# EAGLE design IO BOARD TOP (EAGLE 9.6.2)
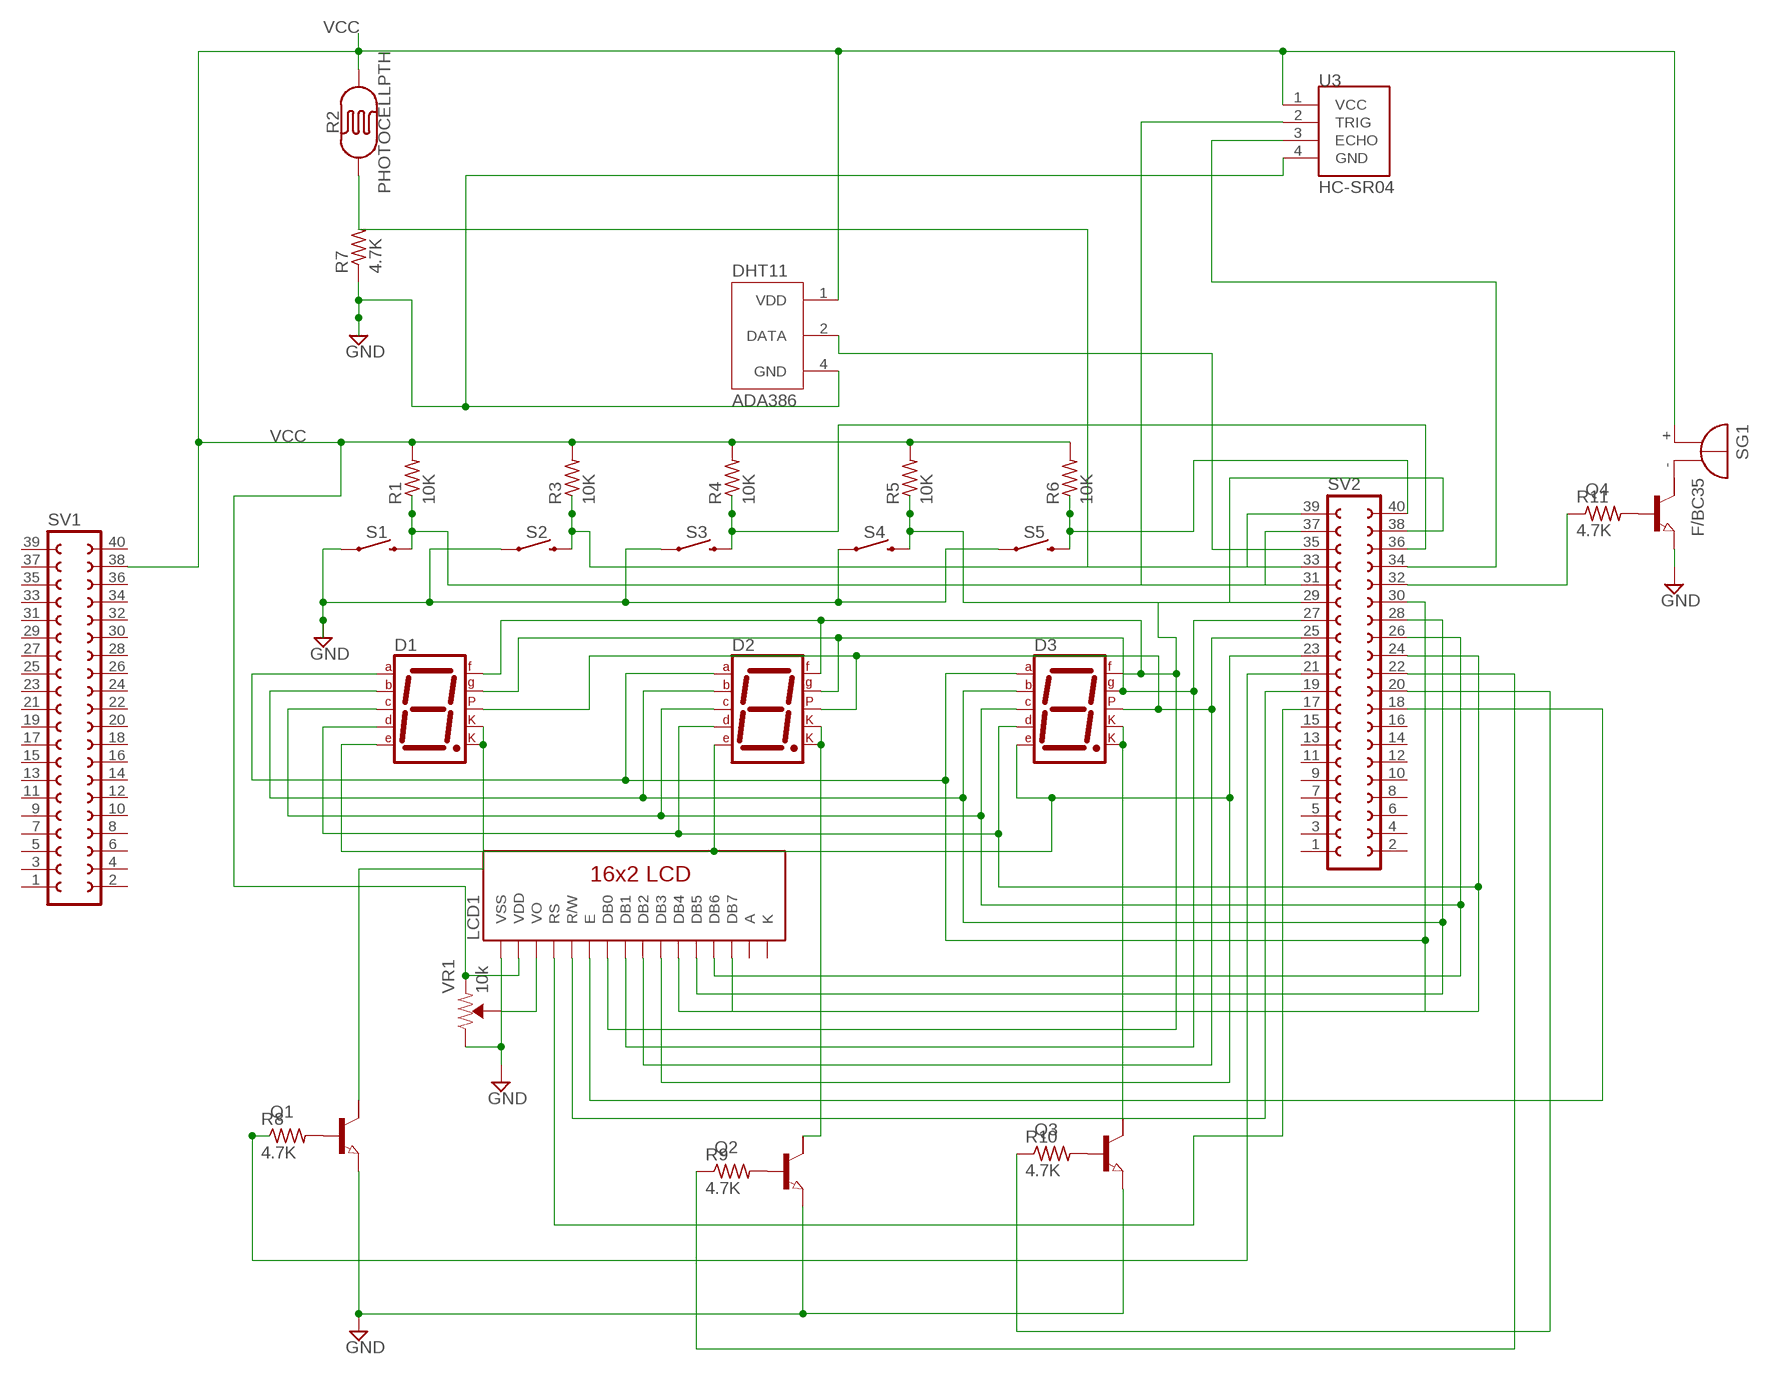
[diagram p0: schematic, sheet 1]

## Parts
D1  7SEG-CK  [7SEG-13]
D2  7SEG-CK  [7SEG-13]
D3  7SEG-CK  [7SEG-13]
DHT11  ADA386  [XDCR_ADA386]
LCD1  LCD-16X2SILK  [LCD-16X2]
Q1  NPN-TRANSISTIOR-2COLSOT89  [SOT89]
Q2  NPN-TRANSISTIOR-2COLSOT89  [SOT89]
Q3  NPN-TRANSISTIOR-2COLSOT89  [SOT89]
Q4  NPN-TRANSISTIOR-2COLSOT89  [SOT89]
R1  10K  R-US_0204/2V  [0204V]
R2  PHOTOCELLPTH  [PHOTOCELL]
R3  10K  R-US_0204/2V  [0204V]
R4  10K  R-US_0204/2V  [0204V]
R5  10K  R-US_0204/2V  [0204V]
R6  10K  R-US_0204/2V  [0204V]
R7  4.7K  R-US_0204/2V  [0204V]
R8  4.7K  R-US_0204/2V  [0204V]
R9  4.7K  R-US_0204/2V  [0204V]
R10  4.7K  R-US_0204/2V  [0204V]
R11  4.7K  R-US_0204/2V  [0204V]
S1  MOMENTARY-SWITCH-SPST-SMD-4.6X2.8MM  [TACTILE_SWITCH_SMD_4.6X2.8MM]
S2  MOMENTARY-SWITCH-SPST-SMD-4.6X2.8MM  [TACTILE_SWITCH_SMD_4.6X2.8MM]
S3  MOMENTARY-SWITCH-SPST-SMD-4.6X2.8MM  [TACTILE_SWITCH_SMD_4.6X2.8MM]
S4  MOMENTARY-SWITCH-SPST-SMD-4.6X2.8MM  [TACTILE_SWITCH_SMD_4.6X2.8MM]
S5  MOMENTARY-SWITCH-SPST-SMD-5.2-REDUNDANT  [TACTILE_SWITCH_SMD_5.2MM]
SG1  F/BC35  [F/BC35]
SV1  FE20-2  [FE20-2]
SV2  FE20-2  [FE20-2]
U3  HC-SR04  [XCVR_HC-SR04]
VR1  10k  TRIMPOT-SMD-3MM-OPEN-1/10W-25%  [TRIMPOT-SMD-TC33X]

## Nets
GND: DHT11.4(GND) LCD1.1(VSS) Q1.3(E) Q2.3(E) Q3.3(E) Q4.3(E) R7.1 S1.1 S1.2 S2.1 S2.2 S3.1 S3.2 S4.1 S4.2 S5.1 S5.2 U3.4(GND) VR1.1(CW)
N$1: R1.1 S1.3 S1.4 SV2.37
N$2: R3.1 S2.3 S2.4 SV2.39
N$3: R4.1 S3.3 S3.4 SV2.36
N$4: R5.1 S4.3 S4.4 SV2.38
N$5: R6.1 S5.3 S5.4 SV2.40
N$6: DHT11.2(DATA) SV2.35
N$7: LCD1.3(VO) VR1.2(WIPER)
N$8: SV2.31 U3.2(TRIG)
N$9: SV2.34 U3.3(ECHO)
N$10: D1.9(F) D2.9(F) D3.9(F) LCD1.7(DB0) SV2.29
N$11: Q4.1(B) R11.2
N$12: D1.6(B) D2.6(B) D3.6(B) LCD1.12(DB5) SV2.28
N$13: R2.1 R7.2 SV2.33
N$14: D1.4(C) D2.4(C) D3.4(C) LCD1.13(DB6) SV2.26
N$15: D1.10(G) D2.10(G) D3.10(G) LCD1.8(DB1) SV2.27
N$16: D1.3(CK1) D1.8(CK2) Q1.2(C)
N$17: D1.1(E) D2.1(E) D3.1(E) LCD1.10(DB3) SV2.23
N$18: D1.7(A) D2.7(A) D3.7(A) LCD1.11(DB4) SV2.30
N$19: D2.3(CK1) D2.8(CK2) Q2.2(C)
N$20: D3.3(CK1) D3.8(CK2) Q3.2(C)
N$21: D1.2(D) D2.2(D) D3.2(D) LCD1.14(DB7) SV2.24
N$22: D1.5(DP) D2.5(DP) D3.5(DP) LCD1.9(DB2) SV2.25
N$23: Q1.1(B) R8.2
N$24: Q2.1(B) R9.2
N$25: Q3.1(B) R10.2
N$27: R9.1 SV2.22
N$28: R10.1 SV2.20
N$29: Q4.2(C) SG1.-
N$30: R11.1 SV2.32
N$31: LCD1.6(E) SV2.18
N$32: LCD1.5(R/W) SV2.19
N$33: LCD1.4(RS) SV2.17
N$35: R8.1 SV2.21
VCC: DHT11.1(VDD) LCD1.2(VDD) R1.2 R2.2 R3.2 R4.2 R5.2 R6.2 SG1.+ SV1.38 U3.1(VCC) VR1.3(CCW)
Unconnected: Q1.2@1(C/) Q2.2@1(C/) Q3.2@1(C/) Q4.2@1(C/) SV1.1 SV1.2 SV1.3 SV1.4 SV1.5 SV1.6 SV1.7 SV1.8 SV1.9 SV1.10 SV1.11 SV1.12 SV1.13 SV1.14 SV1.15 SV1.16 SV1.17 SV1.18 SV1.19 SV1.20 SV1.21 SV1.22 SV1.23 SV1.24 SV1.25 SV1.26 SV1.27 SV1.28 SV1.29 SV1.30 SV1.31 SV1.32 SV1.33 SV1.34 SV1.35 SV1.36 SV1.37 SV1.39 SV1.40 SV2.1 SV2.2 SV2.3 SV2.4 SV2.5 SV2.6 SV2.7 SV2.8 SV2.9 SV2.10 SV2.11 SV2.12 SV2.13 SV2.14 SV2.15 SV2.16

## Power pins joined to a net without a drawn wire
A: LCD1.15(A)
K: LCD1.16(K)

## Library data of the parts
D1-D3 = special:7SEG-CK: 7-segment DISPLAY single cathode, 13 mm
DHT11 = ADA386:ADA386: DHT11 basic temperature-humidity sensor + extras; AVAILABILITY: Unavailable; DESCRIPTION: DHT11 basic temperature-humidity sensor + extras; MF: Adafruit Industries; MP: ADA386; PACKAGE: None; PRICE: None
LCD1 = SparkFun-Displays:LCD-16X2: Standard text-only 16x2 parallel input LCD Basic 16 character by 2 line display. Typically utilizes the extremely common HD44780 parallel interface chipset SparkFun Products: Basic 16x2 Green <https://www.sparkfun.com/products/255> Basic 8x2 Green <https://www.sparkfun.com/products/11122>; PROD_ID: LCD-12633; SF_ID: LCD-00255
Q1-Q4 = semicon-smd-ipc:NPN-TRANSISTIOR-2COL: NPN TRANSISTOR 2 colletor pins
R1 R3-R11 = rcl:R-US_: RESISTOR, American symbol; SPICEPREFIX: R
R2 = SparkFun-Sensors:PHOTOCELL: Photocell (Photodetector, Photo Resistor, CdS) This is a very small light sensor. A photocell changes (also called a photodetector, photo resistor, CdS or photoconductive cell) resistance depending on the amount of light it is exposed to. These little sensors make great ambient light triggers (when light in the room turns on, do something). Datasheet <http://cdn.sparkfun.com/datasheets/Sensors/LightImaging/SEN-09088.pdf> SparkFun Products Mini Photocell <https://www.sparkfun.com/products/9088> (SEN-09088); PROD_ID: COMP-09129; SF_ID: SEN-09088
S1-S4 = SparkFun-Switches:MOMENTARY-SWITCH-SPST: Momentary Switch (Pushbutton) - SPST Normally-open (NO) SPST momentary switches (buttons, pushbuttons). Variants PTH-12MM - 12mm square, through-hole Momentary Pushbutton Switch - 12mm Square <https://www.sparkfun.com/products/9190> (COM-09190) PTH-6.0MM, PTH-6.0MM-KIT - 6.0mm square, through-hole Mini Pushbutton Switch <https://www.sparkfun.com/products/97> (COM-00097) KIT package intended for soldering kit's - only one side of pads' copper is exposed. PTH-RIGHT-ANGLE-KIT - Right-angle, through-hole Right Angle Tactile Button <https://www.sparkfun.com/products/10791> - Used on SparkFun BigTime Watch Kit <https://www.sparkfun.com/products/11734> SMD-12MM - 12mm square, surface-mount Tactile Button - SMD (12mm) <https://www.sparkfun.com/products/12993> (COM-12993) Used on SparkFun PicoBoard <https://www.sparkfun.com/products/11888> SMD-4.5MM - 4.5mm Square Trackball Switch Used on SparkFun Blackberry Trackballer Breakout <https://www.sparkfun.com/products/13169> SMD-4.6MMX2.8MM - 4.60mm x 2.80mm, surface mount Used on SparkFun SAMD21 Mini Breakout <https://www.sparkfun.com/products/13664> SMD-5.2MM, SMD-5.2-REDUNDANT - 5.2mm square, surface-mount Mini Pushbutton Switch - SMD <https://www.sparkfun.com/products/8720> (COM-08720) Used on Arduino Pro Mini <https://www.sparkfun.com/products/11114> REDUNDANT package connects both switch circuits together SMD-6.0X3.5MM - 6.0 x 3.5mm, surface mount Momentary Reset Switch SMD <https://www.sparkfun.com/products/8229> (COM-08229) SMD-6.2MM-TALL - 6.2mm square, surface mount Tactile Button - SMD (6mm) <https://www.sparkfun.com/products/12992> Used on SparkFun Digital Sandbox <https://www.sparkfun.com/products/12651> SMD-RIGHT-ANGLE - Right-angle, surface mount Used on SparkFun Block for Intel® Edison - Arduino <https://www.sparkfun.com/products/13036>; PROD_ID: SWCH-13065
S5 = SparkFun-Switches:MOMENTARY-SWITCH-SPST: Momentary Switch (Pushbutton) - SPST Normally-open (NO) SPST momentary switches (buttons, pushbuttons). Variants PTH-12MM - 12mm square, through-hole Momentary Pushbutton Switch - 12mm Square <https://www.sparkfun.com/products/9190> (COM-09190) PTH-6.0MM, PTH-6.0MM-KIT - 6.0mm square, through-hole Mini Pushbutton Switch <https://www.sparkfun.com/products/97> (COM-00097) KIT package intended for soldering kit's - only one side of pads' copper is exposed. PTH-RIGHT-ANGLE-KIT - Right-angle, through-hole Right Angle Tactile Button <https://www.sparkfun.com/products/10791> - Used on SparkFun BigTime Watch Kit <https://www.sparkfun.com/products/11734> SMD-12MM - 12mm square, surface-mount Tactile Button - SMD (12mm) <https://www.sparkfun.com/products/12993> (COM-12993) Used on SparkFun PicoBoard <https://www.sparkfun.com/products/11888> SMD-4.5MM - 4.5mm Square Trackball Switch Used on SparkFun Blackberry Trackballer Breakout <https://www.sparkfun.com/products/13169> SMD-4.6MMX2.8MM - 4.60mm x 2.80mm, surface mount Used on SparkFun SAMD21 Mini Breakout <https://www.sparkfun.com/products/13664> SMD-5.2MM, SMD-5.2-REDUNDANT - 5.2mm square, surface-mount Mini Pushbutton Switch - SMD <https://www.sparkfun.com/products/8720> (COM-08720) Used on Arduino Pro Mini <https://www.sparkfun.com/products/11114> REDUNDANT package connects both switch circuits together SMD-6.0X3.5MM - 6.0 x 3.5mm, surface mount Momentary Reset Switch SMD <https://www.sparkfun.com/products/8229> (COM-08229) SMD-6.2MM-TALL - 6.2mm square, surface mount Tactile Button - SMD (6mm) <https://www.sparkfun.com/products/12992> Used on SparkFun Digital Sandbox <https://www.sparkfun.com/products/12651> SMD-RIGHT-ANGLE - Right-angle, surface mount Used on SparkFun Block for Intel® Edison - Arduino <https://www.sparkfun.com/products/13036>; PROD_ID: SWCH-08247; SF_SKU: COM-08720
SG1 = buzzer:F/BC35: BUZZER Source: Spoerle; OC_FARNELL: unknown; OC_NEWARK: unknown
SV1 SV2 = con-lsta:FE20-2: FEMALE HEADER; OC_FARNELL: unknown; OC_NEWARK: unknown
U3 = HC-SR04:HC-SR04: Ultrasonic Sensor Module Check prices <https://pricing.snapeda.com/search/part/HC-SR04/?ref=eda>; AVAILABILITY: Bad; DESCRIPTION: HC-SR04 Ultrasonic Sensor Platform Evaluation Expansion Board; MF: OSEPP Electronics LTD; MP: HC-SR04; PACKAGE: None; PRICE: None
VR1 = SparkFun-Resistors:TRIMPOT: Trimming Potentiometer (Trimpot) Three-terminal potentiometers, with an adjustable wiper and two adjustable resistors. A pot can be used to create a configurable voltage divider, or as a variable resistor. "Trimpots" are a subset of potentiometers, usually intended for "set-and-forget" applications. They're often more delicate than standard potentiometers - rated for fewer turns. Variants PTH-KNOB - PTH Trimpot w/ finger-adjustable knob Trimpot 10K with Knob <https://www.sparkfun.com/products/9806> (COM-09806) Datasheet <http://www.sparkfun.com/datasheets/Components/General/TSR-3386.pdf> SMD-3MM-CLOSED-FRAME - SMD 3mm Square Closed-Frame Trimpot Used on e.g. EasyDriver - Stepper Motor Driver <https://www.sparkfun.com/products/12779> Datasheet <http://www.bitechnologies.com/pdfs/22.pdf> (22AR10KTR) SMD-5MM - SMD 5mm Square Closed-Frame Trimpot Used on e.g. IOIO-OTG - V2.2 <https://www.sparkfun.com/products/13613> Datasheet <http://www.vishay.com/docs/51008/ts53.pdf> (TS53YL502MR10) SMD-3MM-1/10W-25% - 3mm Square Open-Frame Trimpot Used on e.g. SparkFun Shapeoko <https://www.sparkfun.com/products/13899> Datasheet <http://www.bourns.com/docs/Product-Datasheets/TC33.pdf> (TC33X-2-103E); PROD_ID: RES-12428, RES-08048

## Board
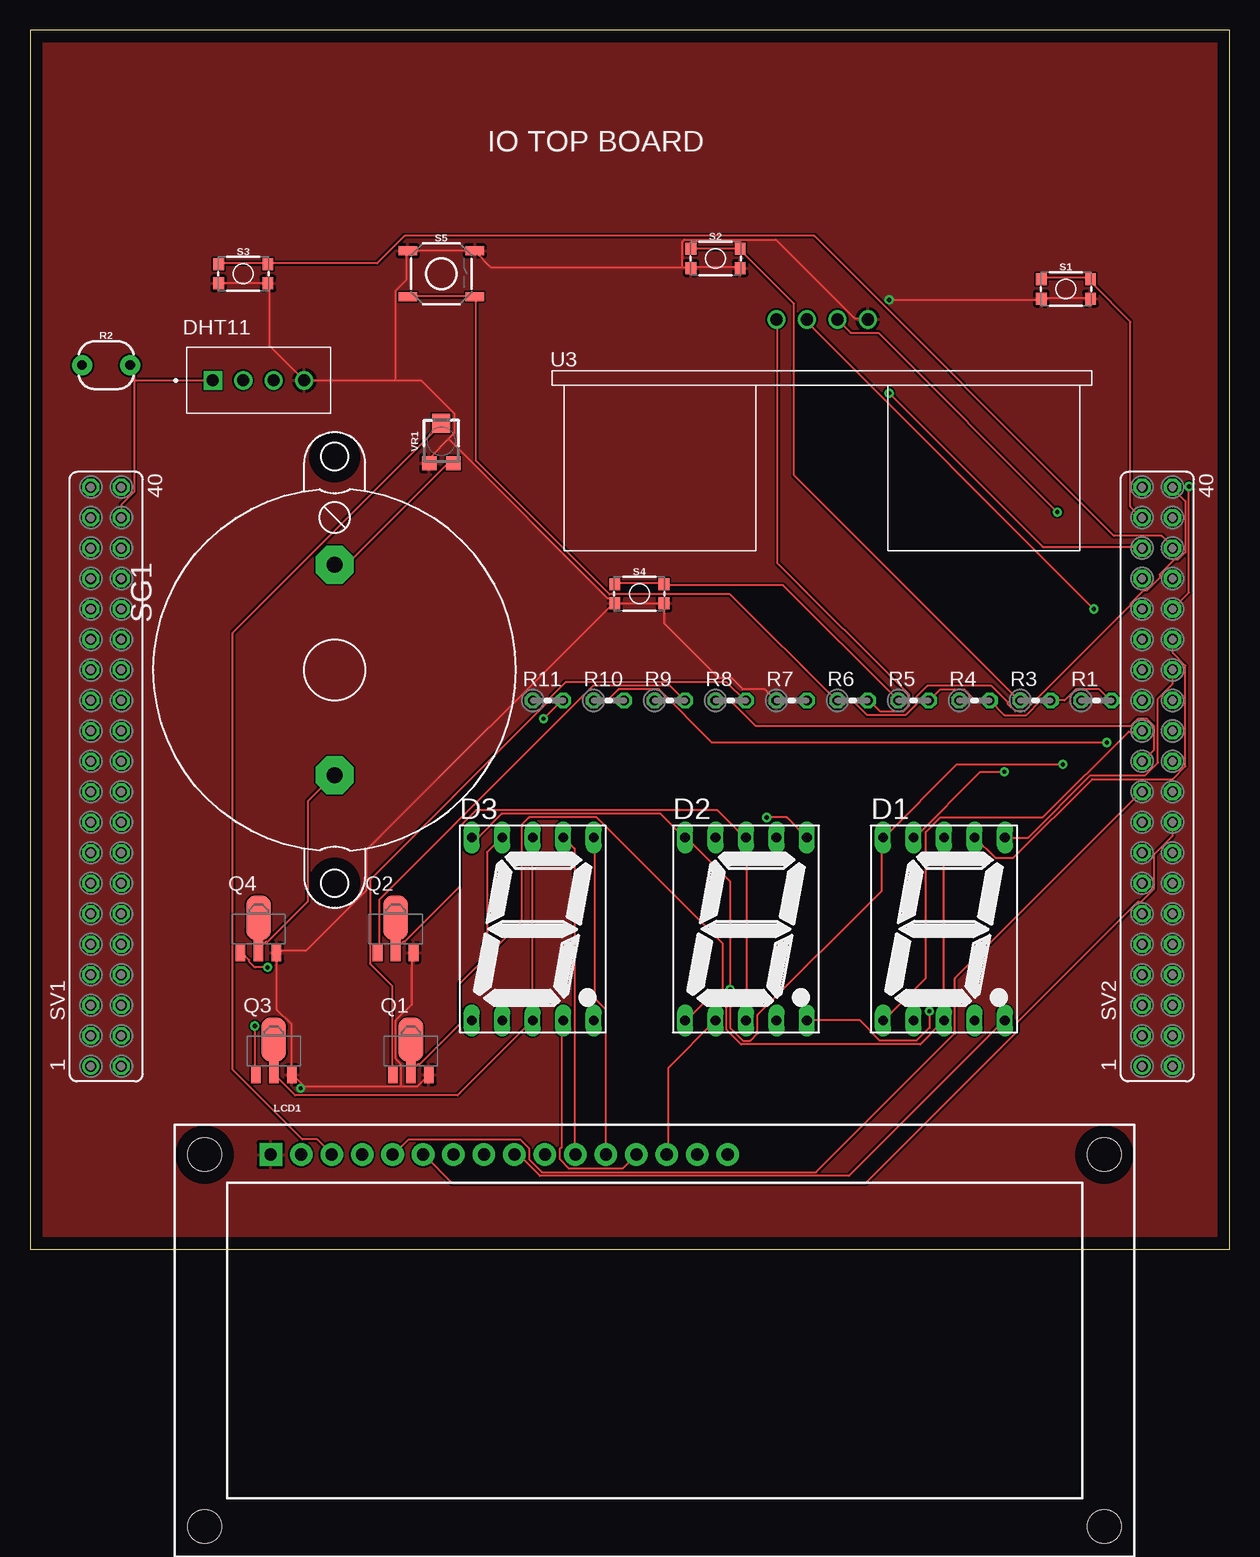
[diagram p1: board, top side]
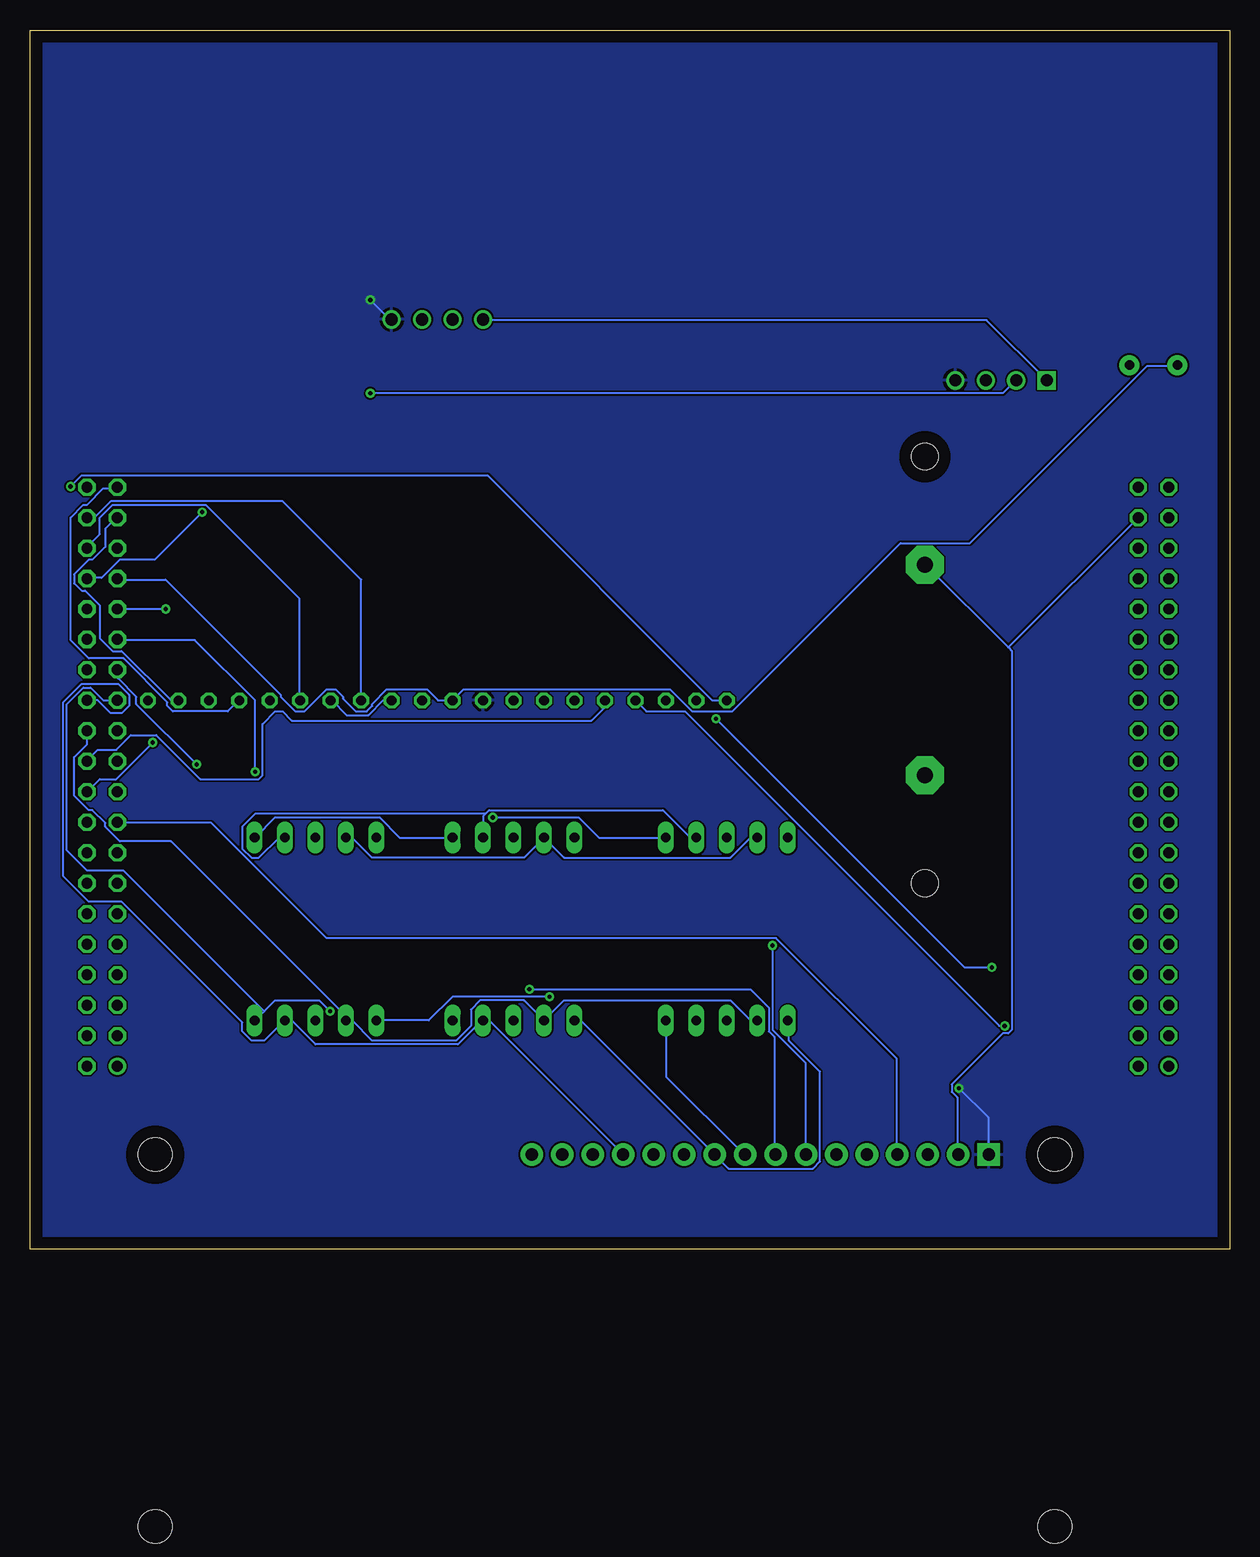
[diagram p2: board, bottom side, seen from below]

Size 100 x 101.59 mm. Coordinates in mm from the lower left corner, seen from the top.
Outline: 0,0 100,0 100,101.59 0,101.59 0,0
Copper layers (1*16): Top 0.035mm / dielectric 1.5mm / Bottom 0.035mm
Design rules "default": minimum track width 6mil, minimum drill 0.35mm, track to track 6mil, track to pad 6mil, pad to pad 6mil, via to via 6mil, smd to smd 6mil, copper to edge 40mil, drill to drill 6mil, minimum pad ring 10mil, minimum via ring 8mil, stop-mask expansion 4mil, vias tented up to drill 0mil, thermal gap 10mil

### Footprints (pad centres in the part's own frame; a part is rotated, then mirrored left to right if it is on the bottom)
7SEG-13 = drill 0.813 long: 1 -5.08,-7.62; 2 -2.54,-7.62; 3 0,-7.62; 4 2.54,-7.62; 5 5.08,-7.62; 6 5.08,7.62; 7 2.54,7.62; 8 0,7.62; 9 -2.54,7.62; 10 -5.08,7.62
XDCR_ADA386 = drill 1.016 square: 1 -3.81,0 | drill 1.016: 2 -1.27,0; 3 1.27,0; 4 3.81,0
LCD-16X2 = drill 1.016 pad 1.88 square: 1 -32,15.5 | drill 1.016 pad 1.88: 2 -29.46,15.5; 3 -26.92,15.5; 4 -24.38,15.5; 5 -21.84,15.5; 6 -19.3,15.5; 7 -16.76,15.5; 8 -14.22,15.5; 9 -11.68,15.5; 10 -9.14,15.5; 11 -6.6,15.5; 12 -4.06,15.5; 13 -1.52,15.5; 14 1.02,15.5; 15 3.56,15.5; 16 6.1,15.5 | hole 2.8: -37.5,15.5; -37.5,-15.5; 37.5,15.5; 37.5,-15.5
SOT89 = smd 0.8 x 1.4: 1 -1.499,-1.981; 3 1.499,-1.981 | smd 0.8 x 1.9: 2 0,-1.727 | smd 2.032 x 3.65: 2@1 0,0.94
0204V = drill 0.813 octagon: 1 -1.27,0; 2 1.27,0
PHOTOCELL = drill 0.8 pad 1.676: 1 -2,0; 2 2,0
TACTILE_SWITCH_SMD_4.6X2.8MM = smd 0.9 x 1: 1 -2.05,-0.8; 2 2.05,-0.8; 3 2.05,0.8; 4 -2.05,0.8
TACTILE_SWITCH_SMD_5.2MM = smd 1.524 x 0.762: 1 -2.794,1.905; 2 2.794,1.905; 3 -2.794,-1.905; 4 2.794,-1.905
F/BC35 = drill 1.321 pad 3.15 octagon: + 8.763,0; - -8.763,0 | hole 2.21: 17.78,0; -17.78,0
FE20-2 = drill 0.914: 1 -24.13,1.27 | drill 0.914 octagon: 2 -24.13,-1.27; 3 -21.59,1.27; 4 -21.59,-1.27; 5 -19.05,1.27; 6 -19.05,-1.27; 7 -16.51,1.27; 8 -16.51,-1.27; 9 -13.97,1.27; 10 -13.97,-1.27; 11 -11.43,1.27; 12 -11.43,-1.27; 13 -8.89,1.27; 14 -8.89,-1.27; 15 -6.35,1.27; 16 -6.35,-1.27; 17 -3.81,1.27; 18 -3.81,-1.27; 19 -1.27,1.27; 20 -1.27,-1.27; 21 1.27,1.27; 22 1.27,-1.27; 23 3.81,1.27; 24 3.81,-1.27; 25 6.35,1.27; 26 6.35,-1.27; 27 8.89,1.27; 28 8.89,-1.27; 29 11.43,1.27; 30 11.43,-1.27; 31 13.97,1.27; 32 13.97,-1.27; 33 16.51,1.27; 34 16.51,-1.27; 35 19.05,1.27; 36 19.05,-1.27; 37 21.59,1.27; 38 21.59,-1.27; 39 24.13,1.27; 40 24.13,-1.27
XCVR_HC-SR04 = drill 1.02: 1 -3.81,0; 2 -1.27,0; 3 1.27,0; 4 3.81,0
TRIMPOT-SMD-TC33X = smd 1.2 x 1.2: 1 -1,-1.825; 3 1,-1.825 | smd 1.5 x 1.6: 2 0,1.5

### Placement (x,y rotation side)
D1  76.2,26.67 0 top
D2  59.69,26.67 0 top
D3  41.91,26.67 0 top
DHT11  19.05,72.39 0 top
LCD1  52.07,-7.62 0 top
Q1  31.75,16.51 0 top
Q2  30.48,26.67 0 top
Q3  20.32,16.51 0 top
Q4  19.05,26.67 0 top
R1  88.9,45.72 0 top
R2  6.35,73.66 0 top
R3  83.82,45.72 0 top
R4  78.74,45.72 0 top
R5  73.66,45.72 0 top
R6  68.58,45.72 0 top
R7  63.5,45.72 0 top
R8  58.42,45.72 0 top
R9  53.34,45.72 0 top
R10  48.26,45.72 0 top
R11  43.18,45.72 0 top
S1  86.36,80.01 0 top
S2  57.15,82.55 0 top
S3  17.78,81.28 0 top
S4  50.8,54.61 0 top
S5  34.29,81.28 0 top
SG1  25.4,48.26 90 top
SV1  6.35,39.37 90 top
SV2  93.98,39.37 90 top
U3  66.04,77.47 0 top
VR1  34.29,67.31 0 top

### Tracks (layer width: path | path; a pad name or v marks a point on that pad's centre or on a via)
GND  (via drill 0.35)
  Top 0.152: S1.2 88.39,79.25 84.43,79.25 S1.1 84.28,79.1 v71.63,79.1 | S2.2 59.13,81.84 55.17,81.84 S2.1 55.02,81.84 54.41,81.84 | 54.41,81.84 38.41,81.84 37.19,83.06 S5.2 37.03,83.21 31.55,83.21 S5.1 31.39,83.06 31.39,80.77 30.48,79.86 30.48,72.39 | 54.41,81.84 54.41,83.97 54.56,84.12 62.18,84.12 68.73,77.57 69.8,77.57 U3.4 | 30.94,13.56 22.86,13.56 22.55,13.87 | 30.94,13.56 32.31,13.56 33.22,14.48 Q1.3 | 22.55,13.87 21.95,14.48 Q3.3 21.79,14.63 21.79,18.75 20.57,19.96 20.57,24.69 Q4.3 20.57,24.84 23.01,24.84 28.04,29.87 28.04,33.22 48.62,53.8 S4.1 | 30.94,13.56 30.94,15.39 30.48,15.85 30.48,19.05 31.85,20.42 31.85,24.69 Q2.3 | 22.55,13.87 v22.55,13.41 | S4.1 48.77,53.8 52.73,53.8 S4.2 52.88,53.8 52.88,52.12 57.45,47.55 58.52,47.55 59.44,46.63 61.27,46.63 62.18,45.72 R7.1 | S3.1 15.85,80.47 19.81,80.47 S3.2 19.96,80.47 19.96,75.29 DHT11.4 30.48,72.39 | 34.9,67.51 35.36,67.97 35.36,69.65 32.61,72.39 30.48,72.39 | 34.9,67.51 33.38,65.99 33.38,65.53 VR1.1 | 34.9,67.51 48.16,54.25 48.31,54.25 48.62,53.95 S4.1
  Bottom 0.152: v71.63,79.1 69.95,77.42 U3.4 | v22.55,13.41 20.12,10.97 20.12,7.92 LCD1.1
  pour Top: -11.43,105.41 113.03,105.41 114.3,104.14 114.3,-6.35 107.95,-12.7 -2.54,-12.7 -8.89,-6.35 -11.43,-3.81
  pour Bottom: -17.78,109.22 121.92,109.22 121.92,-12.7 119.38,-15.24 -12.7,-15.24 -15.24,-12.7 -17.78,-10.16
N$1
  Top 0.152: S1.4 84.43,80.92 88.39,80.92 S1.3 88.54,80.77 88.54,80.47 91.75,77.27 91.75,61.87 92.66,60.96 SV2.37
  Bottom 0.152: R1.1 88.24,45.72 92.35,49.84 93.12,49.84 94.18,50.9 94.18,53.65 95.4,54.86 95.71,54.86 96.32,55.47 96.32,56.24 95.1,57.45 94.79,57.45 93.73,58.52 93.73,60.05 92.81,60.96 SV2.37
N$2
  Top 0.152: S2.4 55.17,83.36 59.13,83.36 S2.3 59.28,83.21 63.7,78.79 63.7,64.47 82.45,45.72 R3.1
  Bottom 0.152: SV2.39 92.81,63.4 93.88,63.4 95.25,62.03 95.56,62.03 96.62,60.96 96.62,50.75 95.1,49.23 92.2,49.23 88.54,45.57 88.54,45.26 88.09,44.81 83.52,44.81 82.6,45.72 R3.1
N$3
  Top 0.152: S3.4 15.85,82.14 19.81,82.14 S3.3 19.96,82.14 28.96,82.14 31.24,84.43 65.38,84.43 90.37,59.44 94.34,59.44 95.25,58.52 SV2.36
  Bottom 0.152: R4.1 77.57,45.72 77.57,54.25 85.34,62.03 93.12,62.03 94.18,60.96 94.18,59.59 95.25,58.52 SV2.36
N$4
  Top 0.152: S4.4 48.77,55.47 52.73,55.47 S4.3 52.88,55.32 62.79,55.32 R5.1
  Bottom 0.152: SV2.38 94.64,60.96 93.27,62.33 78.94,62.33 72.39,55.78 R5.1
N$5
  Top 0.152: S5.3 31.55,79.4 37.03,79.4 S5.4 37.19,79.25 37.19,65.68 48.31,54.56 58.37,54.56 67.21,45.72 R6.1 68.58,45.72 69.8,44.5 73,44.5 73.91,45.41 73.91,46.02 74.83,46.94 80.16,46.94 81.53,45.57 81.53,45.41 82.14,44.81 82.91,44.81 91.75,53.65 91.75,53.8 92.81,54.86 93.12,54.86 94.18,55.93 94.18,56.24 95.4,57.45 95.71,57.45 96.32,58.06 96.32,62.33 95.25,63.4 SV2.40
N$6  (via drill 0.35)
  Top 0.152: v71.63,71.32 84.43,58.52 92.66,58.52 SV2.35
  Bottom 0.152: v71.63,71.32 18.9,71.32 17.83,72.39 DHT11.2
N$7
  Top 0.152: VR1.2 34.29,68.73 16.92,51.36 16.92,14.94 22.71,9.14 23.93,9.14 25.15,7.92 LCD1.3
N$8  (via drill 0.35)
  Top 0.152: v88.7,53.34 64.77,77.27 U3.2
  Bottom 0.152: v88.7,53.34 SV2.31
N$9  (via drill 0.35)
  Top 0.152: v85.65,61.42 70.71,76.35 68.43,76.35 U3.3
  Bottom 0.152: v85.65,61.42 89.61,57.45 92.51,57.45 94.03,55.93 95.25,55.93 SV2.34
N$10  (via drill 0.35)
  Top 0.152: v81.23,39.78 79.25,39.78 73.76,34.29 D1.9 | v38.1,25.3 38.1,33.07 39.32,34.29 D3.9
  Bottom 0.152: D3.9 39.93,34.29 41.6,32.61 55.47,32.61 D2.9 58.83,32.61 71.48,32.61 73.15,34.29 D1.9 | v81.23,39.78 81.23,45.72 86.26,50.75 92.66,50.75 SV2.29 | v38.1,25.3 38.1,18.29 35.36,15.54 35.36,7.92 LCD1.7
N$11  (via drill 0.35)
  Top 0.152: v19.81,23.47 18.75,23.47 18.29,23.93 18.29,24.08 17.68,24.69 Q4.1 | v42.82,44.2 44.35,45.72 R11.2
  Bottom 0.152: v19.81,23.47 22.1,23.47 v42.82,44.2
N$12  (via drill 0.35)
  Top 0.152: D3.6 47.09,34.29 47.09,20.88 48.01,19.96 48.01,7.92 LCD1.12 | SV2.28 95.25,47.09 94.03,45.87 94.03,40.54 92.96,39.47 88.39,39.47 83.21,34.29 D1.6 | v61.42,35.97 63.09,35.97 D2.6
  Bottom 0.152: D2.6 69.19,34.29 70.87,35.97 79.55,35.97 81.23,34.29 D1.6 | D3.6 52.58,34.29 54.25,35.97 v61.42,35.97
N$13
  Bottom 0.152: SV2.33 92.66,55.78 88.7,55.78 79.1,46.18 79.1,46.02 77.88,44.81 77.11,44.81 75.29,46.63 74.52,46.63 73.91,46.02 73.91,45.87 72.85,44.81 71.93,44.81 71.48,45.26 71.48,45.41 70.26,46.63 66.9,46.63 65.99,45.72 R7.2 63.86,46.63 46.63,46.63 44.81,44.81 41.45,44.81 27.43,58.83 21.64,58.83 6.86,73.61 4.42,73.61 R2.1
N$14
  Top 0.152: D3.4 44.35,19.05 44.35,8.53 44.2,8.38 44.2,7.47 44.96,6.71 49.38,6.71 50.44,7.77 LCD1.13
  Bottom 0.152: LCD1.13 50.6,7.92 61.72,19.05 D2.4 62.33,19.05 64.31,17.07 76.2,17.07 78.18,19.05 D1.4 78.79,19.05 80.47,17.37 81.53,17.37 82.3,18.14 82.3,18.9 92.35,28.96 95.1,28.96 97.23,31.09 97.23,45.57 95.71,47.09 92.66,47.09 91.75,46.18 91.75,45.26 92.35,44.65 93.27,44.65 94.34,45.72 SV2.26
N$15  (via drill 0.35)
  Top 0.152: D3.10 37.34,34.29 39.32,36.27 52.58,36.27 54.56,34.29 D2.10 54.71,34.29 58.37,30.63 v58.37,21.64 58.37,18.44 59.44,17.37 60.05,17.37 60.66,17.98 60.66,19.51 71.02,29.87 71.02,34.29 D1.10 71.17,34.29 77.27,40.39 v86.11,40.39
  Bottom 0.152: v86.11,40.39 91.14,45.41 91.14,46.02 92.66,47.55 92.66,48.16 SV2.27 | v58.37,21.64 39.93,21.64 38.41,20.12 38.41,18.14 37.95,17.68 37.95,7.92 LCD1.8
N$16
  Top 0.152: Q1.2 31.85,14.94 32.31,15.39 32.46,15.39 35.81,18.75 35.81,22.1 41,27.28 41,35.36 41.6,35.97 47.24,35.97 57.76,25.45 57.76,20.42 58.06,20.12 58.06,18.29 59.28,17.07 74.22,17.07 D1.3 D1.8
N$17  (via drill 0.35)
  Top 0.152: v56.69,21.03 54.71,19.05 D2.1 | SV2.23 92.66,43.13 91.59,43.13 84.43,35.97 75.89,35.97 74.68,34.75 74.68,22.55 71.17,19.05 D1.1
  Bottom 0.152: D3.1 36.73,19.05 36.73,17.37 34.14,14.78 34.14,7.32 34.75,6.71 41.76,6.71 42.82,7.77 LCD1.10 42.98,7.92 54.1,19.05 D2.1 | D1.1 66.75,19.05 64.77,21.03 v56.69,21.03
N$18
  Top 0.152: SV2.30 95.25,49.68 96.32,48.62 96.32,40.23 95.25,39.17 88.54,39.17 81.99,32.61 80.47,32.61 78.79,34.29 D1.7 | LCD1.11 45.41,7.92 45.41,33.38 44.5,34.29 D3.7
  Bottom 0.152: D3.7 44.96,34.29 47.24,36.58 61.72,36.58 62.03,36.27 | 62.03,36.27 62.18,36.12 62.18,34.29 D2.7 | D1.7 79.25,34.29 80.92,32.61 81.53,32.61 82.3,33.38 82.3,35.2 81.23,36.27 62.03,36.27
N$19
  Top 0.152: Q2.2 30.48,24.99 31.09,25.6 31.24,25.6 35.81,30.18 35.81,35.2 37.19,36.58 57.3,36.58 59.59,34.29 D2.8 59.74,34.29 59.74,19.05 D2.3
N$20
  Top 0.152: Q3.2 20.42,14.78 20.42,14.48 22.1,12.8 35.66,12.8 D3.3 D3.8
N$21
  Top 0.152: D2.2 53.19,15.09 53.19,7.92 LCD1.14
  Bottom 0.152: D3.2 39.93,19.05 41.6,20.73 55.47,20.73 D2.2 58.83,20.73 62.48,20.73 63.25,19.96 63.25,18.59 64.47,17.37 71.48,17.37 73.15,19.05 D1.2 73.76,19.05 73.76,19.51 88.24,33.98 92.51,33.98 93.73,35.2 93.73,35.51 94.79,36.58 95.1,36.58 96.32,37.8 96.32,41 95.25,42.06 SV2.24
N$22  (via drill 0.35)
  Top 0.152: D2.5 69.19,19.05 70.87,17.37 73.91,17.37 74.98,18.44 v74.98,19.81 | LCD1.9 40.54,7.77 40.84,7.77 42.52,6.1 68.28,6.1 81.23,19.05 D1.5
  Bottom 0.152: D3.5 46.94,19.05 46.94,14.33 40.54,7.92 LCD1.9 | v74.98,19.81 75.89,20.73 79.55,20.73 80.47,19.81 | 80.47,19.81 81.23,19.05 D1.5 | SV2.25 93.88,45.72 94.94,46.79 95.56,46.79 96.93,45.41 96.93,33.22 95.25,31.55 92.2,31.55 80.47,19.81
N$23
  Top 0.152: Q1.1 30.18,14.63 30.18,21.95 28.35,23.77 28.35,30.79 43.43,45.87 43.43,46.02 44.65,47.24 58.06,47.24 59.59,45.72 R8.2
N$24
  Top 0.152: Q2.1 29.11,24.84 29.11,29.11 46.94,46.94 53.34,46.94 54.56,45.72 R9.2
N$25  (via drill 0.35)
  Top 0.152: v18.75,18.59 18.75,14.63 Q3.1
  Bottom 0.152: v18.75,18.59 19.2,18.59 45.41,44.81 48.62,44.81 R10.2
N$27
  Bottom 0.152: R9.1 52.12,45.72 52.12,45.11 53.19,44.04 78.18,44.04 78.94,44.81 79.55,44.81 80.62,43.74 80.62,39.47 80.92,39.17 85.8,39.17 89.46,42.82 91.59,42.82 92.81,41.6 94.34,41.6 95.25,40.69 SV2.22
N$28  (via drill 0.35)
  Top 0.152: R10.1 48.16,45.72 49.07,46.63 52.43,46.63 56.84,42.22 v89.76,42.22
  Bottom 0.152: v89.76,42.22 92.81,39.17 94.18,39.17 SV2.20
N$29
  Top 0.152: Q4.2 19.05,24.99 19.66,25.6 19.81,25.6 23.16,28.96 23.16,37.34 25.3,39.47 SG1.-
N$30  (via drill 0.35)
  Top 0.152: v96.62,63.55 96.62,54.71 SV2.32
  Bottom 0.152: R11.1 43.13,45.72 61.87,64.47 95.71,64.47 v96.62,63.55
N$31
  Top 0.152: SV2.18 95.25,34.44 93.73,32.92 93.73,30.02 92.66,28.96 92.35,28.96 82.3,18.9 82.3,18.14 69.65,5.49 35.2,5.49 32.92,7.77 LCD1.6
N$32
  Top 0.152: SV2.19 92.66,38.1 77.11,22.55 77.11,17.98 65.53,6.4 42.67,6.4 41.6,7.47 41.6,8.38 40.84,9.14 31.55,9.14 30.33,7.92 LCD1.5
N$33
  Bottom 0.152: SV2.17 92.66,35.51 84.89,35.51 75.29,25.91 37.8,25.91 27.74,15.85 27.74,7.92 LCD1.4
N$35
  Top 0.152: R8.1 58.37,45.72 60.5,43.59 91.75,43.59 92.35,44.2 93.12,44.2 93.73,43.59 93.73,41.6 92.81,40.69 SV2.21
VCC
  Top 0.152: R1.2 90.07,45.72 89.15,46.63 87.17,46.63 86.26,45.72 R3.2 84.28,45.72 83.06,44.5 81.23,44.5 R4.2 78.79,45.72 77.88,46.63 75.89,46.63 74.98,45.72 R5.2 | U3.1 62.33,77.42 62.33,57.15 73.3,46.18 73.3,45.26 72.85,44.81 70.87,44.81 69.95,45.72 R6.2 | SV1.38 7.62,62.03 8.69,63.09 8.69,72.39 | 8.69,72.39 8.69,73.3 8.38,73.61 R2.2 | 8.69,72.39 DHT11.1 | VR1.3 35.2,65.38 34.75,65.38 26.52,57.15 25.45,57.15 SG1.+
  Bottom 0.152: R6.2 70.56,45.72 71.78,44.5 73.61,44.5 74.83,45.72 R5.2 | 18.44,50.14 25.3,57 SG1.+ | 18.44,50.14 18.14,49.84 18.14,18.29 18.44,17.98 18.9,17.98 23.16,13.72 23.16,13.11 22.71,12.65 22.71,7.92 LCD1.2 | 18.44,50.14 SV1.38 | DHT11.1 20.27,77.42 62.18,77.42 U3.1

### Text on the board
tPlace: IO TOP BOARD